# Altium schematic sheet MCU176_2.SchDoc
size A2
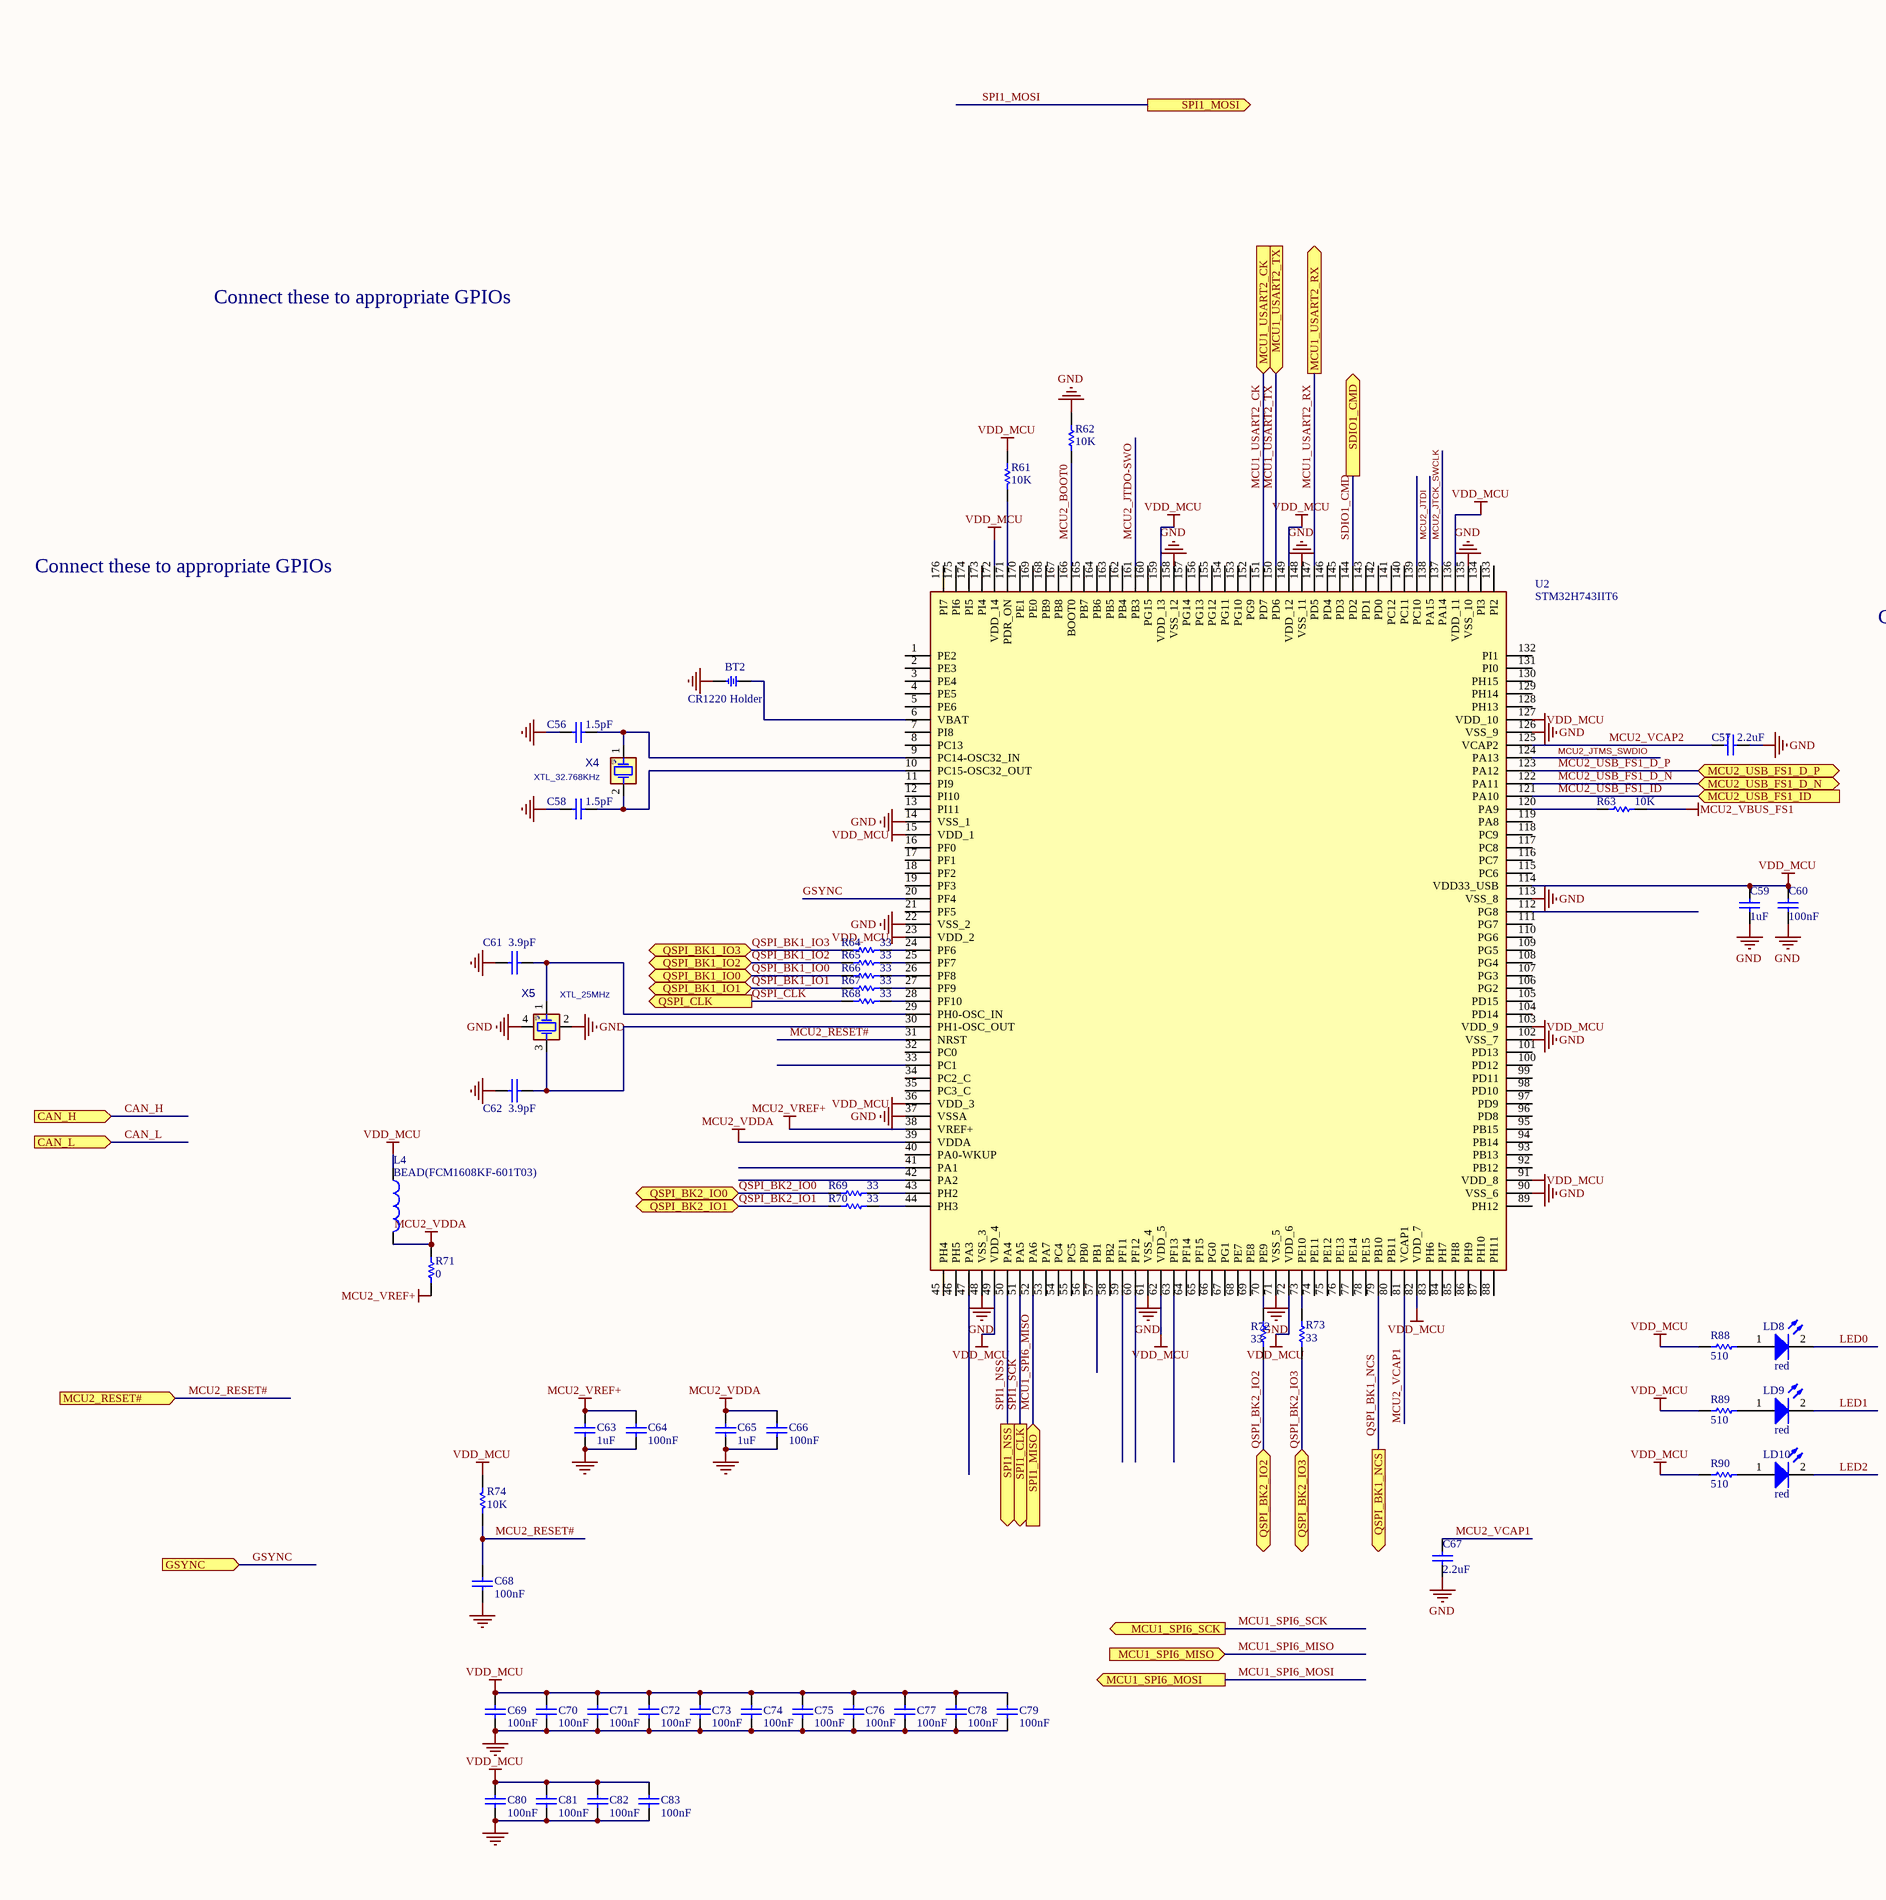
[diagram p0: MCU176_2.SchDoc, left]
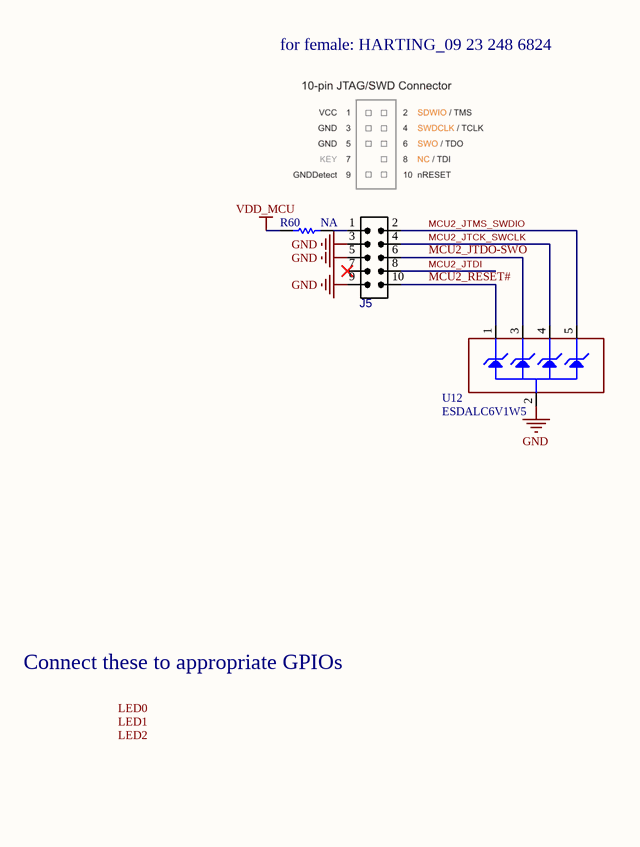
[diagram p1: MCU176_2.SchDoc, right]

## Parts
BT2  CR1220 Holder  [BTH1220]
C56  1.5pF  [C0603E]
C57  2.2uF  [C0603E]
C58  1.5pF  [C0603E]
C59  1uF  [C0603E]
C60  100nF  [C0603E]
C61  3.9pF  [C0603E]
C62  3.9pF  [C0603E]
C63  1uF  [C0603E]
C64  100nF  [C0603E]
C65  1uF  [C0603E]
C66  100nF  [C0603E]
C67  2.2uF  [C0603E]
C68  100nF  [C0603E]
C69  100nF  [C0603E]
C70  100nF  [C0603E]
C71  100nF  [C0603E]
C72  100nF  [C0603E]
C73  100nF  [C0603E]
C74  100nF  [C0603E]
C75  100nF  [C0603E]
C76  100nF  [C0603E]
C77  100nF  [C0603E]
C78  100nF  [C0603E]
C79  100nF  [C0603E]
C80  100nF  [C0603E]
C81  100nF  [C0603E]
C82  100nF  [C0603E]
C83  100nF  [C0603E]
J5  IDC_2X5  [IDC_2X5]  (value not drawn)
L4  BEAD(FCM1608KF-601T03)  [L0603E]
LD8  red  [LED0603GRN]
LD9  red  [LED0603GRN]
LD10  red  [LED0603GRN]
R60  NA  [R0603E]
R61  10K  [R0603E]
R62  10K  [R0603E]
R63  10K  [R0603E]
R64  33  [R0603E]
R65  33  [R0603E]
R66  33  [R0603E]
R67  33  [R0603E]
R68  33  [R0603E]
R69  33  [R0603E]
R70  33  [R0603E]
R71  0  [R0603E]
R72  33  [R0603E]
R73  33  [R0603E]
R74  10K  [R0603E]
R88  510  [R0603E]
R89  510  [R0603E]
R90  510  [R0603E]
U2  STM32H743IIT6  [QFP50P2600X2600X160-176N]
U12  ESDALC6V1W5  [SOT65P210X110-5N]
X4  XTL_32.768KHz  [XTL_2_1610]
X5  XTL_25MHz  [XTL_4_2016]

## Ports
CAN_H (in), CAN_L (in), GSYNC (in), MCU1_SPI6_MISO (in), MCU1_SPI6_MOSI (out), MCU1_SPI6_SCK (out), MCU1_USART2_CK (in), MCU1_USART2_RX (out), MCU1_USART2_TX (in), MCU2_RESET# (in), MCU2_USB_FS1_D_N (bidir), MCU2_USB_FS1_D_P (bidir), MCU2_USB_FS1_ID (in), QSPI_BK1_IO0 (bidir), QSPI_BK1_IO1 (bidir), QSPI_BK1_IO2 (bidir), QSPI_BK1_IO3 (bidir), QSPI_BK1_NCS (out), QSPI_BK2_IO0 (bidir), QSPI_BK2_IO1 (bidir), QSPI_BK2_IO2 (bidir), QSPI_BK2_IO3 (bidir), QSPI_CLK (out), SDIO1_CMD (out), SPI1_CLK (out), SPI1_MISO (in), SPI1_MOSI (out), SPI1_NSS (out)

## Nets
GND: BT2.2 C56.2 C57.2 C58.2 C59.1 C60.1 C61.2 C62.2 C63.1 C64.1 C65.1 C66.1 C67.1 C68.1 C69.2 C70.2 C71.2 C72.2 C73.2 C74.2 C75.2 C76.2 C77.2 C78.2 C79.2 C80.2 C81.2 C82.2 C83.2 J5.3 J5.5 J5.9 R62.2 U2.14(VSS_1) U2.22(VSS_2) U2.37(VSSA) U2.48(VSS_3) U2.61(VSS_4) U2.71(VSS_5) U2.90(VSS_6) U2.102(VSS_7) U2.113(VSS_8) U2.126(VSS_9) U2.135(VSS_10) U2.148(VSS_11) U2.158(VSS_12) U12.2(GND) X5.2(GND1) X5.4(GND2)
MCU2_VBUS_FS1: R63.1
MCU2_VDDA: C65.2 C66.2 L4.2 R71.1 U2.39(VDDA)
MCU2_VREF+: C63.2 C64.2 R71.2 U2.38(VREF+)
VDD_MCU: C59.2 C60.2 C69.1 C70.1 C71.1 C72.1 C73.1 C74.1 C75.1 C76.1 C77.1 C78.1 C79.1 C80.1 C81.1 C82.1 C83.1 L4.1 R60.2 R61.1 R74.1 R88.2 R89.2 R90.2 U2.15(VDD_1) U2.23(VDD_2) U2.36(VDD_3) U2.49(VDD_4) U2.62(VDD_5) U2.72(VDD_6) U2.82(VDD_7) U2.91(VDD_8) U2.103(VDD_9) U2.114(VDD33_USB) U2.127(VDD_10) U2.136(VDD_11) U2.149(VDD_12) U2.159(VDD_13) U2.172(VDD_14)
CAN_H: port CAN_H
CAN_L: port CAN_L
GSYNC: U2.20(PF4) ; port GSYNC
LED0: LD8.2(K)
LED1: LD9.2(K)
LED2: LD10.2(K)
MCU1_SPI6_MISO: U2.52(PA6) ; port SPI1_MISO, port MCU1_SPI6_MISO
MCU1_SPI6_MOSI: port MCU1_SPI6_MOSI
MCU1_SPI6_SCK: port MCU1_SPI6_SCK
MCU1_USART2_CK: U2.151(PD7) ; port MCU1_USART2_CK
MCU1_USART2_RX: U2.147(PD5) ; port MCU1_USART2_RX
MCU1_USART2_TX: U2.150(PD6) ; port MCU1_USART2_TX
MCU2_BOOT0: R62.1 U2.166(BOOT0)
MCU2_JTCK_SWCLK: J5.4 U2.137(PA14) U12.4(IO3)
MCU2_JTDI: J5.8 U2.138(PA15)
MCU2_JTDO-SWO: J5.6 U2.161(PB3) U12.3(IO2)
MCU2_JTMS_SWDIO: J5.2 U2.124(PA13) U12.5(IO4)
MCU2_RESET#: C68.2 J5.10 R74.2 U2.31(NRST) U12.1(IO1) ; port MCU2_RESET#
MCU2_USB_FS1_D_N: U2.122(PA11) ; port MCU2_USB_FS1_D_N
MCU2_USB_FS1_D_P: U2.123(PA12) ; port MCU2_USB_FS1_D_P
MCU2_USB_FS1_ID: U2.121(PA10) ; port MCU2_USB_FS1_ID
MCU2_VCAP1: C67.2 U2.81(VCAP1)
MCU2_VCAP2: C57.1 U2.125(VCAP2)
QSPI_BK1_IO0: R66.2 ; port QSPI_BK1_IO0
QSPI_BK1_IO1: R67.2 ; port QSPI_BK1_IO1
QSPI_BK1_IO2: R65.2 ; port QSPI_BK1_IO2
QSPI_BK1_IO3: R64.2 ; port QSPI_BK1_IO3
QSPI_BK1_NCS: U2.79(PB10) ; port QSPI_BK1_NCS
QSPI_BK2_IO0: R69.2 ; port QSPI_BK2_IO0
QSPI_BK2_IO1: R70.2 ; port QSPI_BK2_IO1
QSPI_BK2_IO2: R72.2 ; port QSPI_BK2_IO2
QSPI_BK2_IO3: R73.2 ; port QSPI_BK2_IO3
QSPI_CLK: R68.2 ; port QSPI_CLK
SDIO1_CMD: U2.144(PD2) ; port SDIO1_CMD
SPI1_MOSI: port SPI1_MOSI
SPI1_NSS: U2.50(PA4) ; port SPI1_NSS
SPI1_SCK: U2.51(PA5) ; port SPI1_CLK
NetBT2_1: BT2.1 U2.6(VBAT)
NetC56_1: C56.1 U2.9(PC14-OSC32_IN) X4.1(OSC1)
NetC58_1: C58.1 U2.10(PC15-OSC32_OUT) X4.2(OSC2)
NetC61_1: C61.1 U2.29(PH0-OSC_IN) X5.1(XA)
NetC62_1: C62.1 U2.30(PH1-OSC_OUT) X5.3(XB)
NetJ5_1: J5.1 R60.1
NetLD8_1: LD8.1(A) R88.1
NetLD9_1: LD9.1(A) R89.1
NetLD10_1: LD10.1(A) R90.1
NetR61_2: R61.2 U2.171(PDR_ON)
NetR63_2: R63.2 U2.120(PA9)
NetR64_1: R64.1 U2.24(PF6)
NetR65_1: R65.1 U2.25(PF7)
NetR66_1: R66.1 U2.26(PF8)
NetR67_1: R67.1 U2.27(PF9)
NetR68_1: R68.1 U2.28(PF10)
NetR69_1: R69.1 U2.43(PH2)
NetR70_1: R70.1 U2.44(PH3)
NetR72_1: R72.1 U2.70(PE9)
NetR73_1: R73.1 U2.73(PE10)

Not connected (* = marked no-connect by the designer): J5 7*; U2 1(PE2) 2(PE3) 3(PE4) 4(PE5) 5(PE6) 7(PI8) 8(PC13) 11(PI9) 12(PI10) 13(PI11) 16(PF0) 17(PF1) 18(PF2) 19(PF3) 21(PF5) 32(PC0) 33(PC1) 34(PC2_C) 35(PC3_C) 40(PA0-WKUP) 41(PA1) 42(PA2) 45(PH4) 46(PH5) 47(PA3) 53(PA7) 54(PC4) 55(PC5) 56(PB0) 57(PB1) 58(PB2) 59(PF11) 60(PF12) 63(PF13) 64(PF14) 65(PF15) 66(PG0) 67(PG1) 68(PE7) 69(PE8) 74(PE11) 75(PE12) 76(PE13) 77(PE14) 78(PE15) 80(PB11) 83(PH6) 84(PH7) 85(PH8) 86(PH9) 87(PH10) 88(PH11) 89(PH12) 92(PB12) 93(PB13) 94(PB14) 95(PB15) 96(PD8) 97(PD9) 98(PD10) 99(PD11) 100(PD12) 101(PD13) 104(PD14) 105(PD15) 106(PG2) 107(PG3) 108(PG4) 109(PG5) 110(PG6) 111(PG7) 112(PG8) 115(PC6) 116(PC7) 117(PC8) 118(PC9) 119(PA8) 128(PH13) 129(PH14) 130(PH15) 131(PI0) 132(PI1) 133(PI2) 134(PI3) 139(PC10) 140(PC11) 141(PC12) 142(PD0) 143(PD1) 145(PD3) 146(PD4) 152(PG9) 153(PG10) 154(PG11) 155(PG12) 156(PG13) 157(PG14) 160(PG15) 162(PB4) 163(PB5) 164(PB6) 165(PB7) 167(PB8) 168(PB9) 169(PE0) 170(PE1) 173(PI4) 174(PI5) 175(PI6) 176(PI7)

## Notes on the sheet
- for female: HARTING_09 23 248 6824
- Connect these to appropriate GPIOs
- Labels drawn without touching a wire or pin: LED0, LED1, LED2

## Library data of the parts
BT2 = BATH_CR1220: BATTERY HOLDER, CR1220; VALUE: BAT3volt; MANF_P#: -; .: http://www.chila.ir
C56 C58 = Capacitor_ST: Capacitor 0402 / 0603 / 0805; Value: 100nF; Revision: July-2002: Re-released for DXP Platform.
C57 C59 C60 C63-C67 = Cap: Capacitor; Value: 10nF; Published: 8-Jun-2000; Revision: July-2002: Re-released for DXP Platform.; Publisher: Altium Limited
C61 C62 C69-C83 = CAP: Capacitor
  C69-C83: Published: 8-Jun-2000; Revision: July-2002: Re-released for DXP Platform.; Publisher: Altium Limited; Value: 100nF
C68 = CAP: Capacitor; Value: 100pF; Published: 8-Jun-2000; Revision: July-2002: Re-released for DXP Platform.; Publisher: Altium Limited
J5 = IDC_2X5: CONN, IDC, Male, pitch: 2.54mm, 10POS; VALUE: IDC_2X5
L4 = Inductor: Value: 100uH; Published: 8-Jun-2000; Revision: July-2002: Re-released for DXP Platform.; Publisher: Altium Limited
LD8-LD10 = LED2: Typical RED, GREEN, YELLOW, AMBER GaAs LED; Published: 8-Jun-2000; Revision: July-2002: Re-released for DXP Platform.; Publisher: Altium Limited
R60 R61 R63-R74 = Res1: Resistor; Value: 1K; Published: 8-Jun-2000; Revision: July-2002: Re-released for DXP Platform.; Publisher: Altium Limited
R62 R88-R90 = res1: Resistor; Value: 1K; Published: 8-Jun-2000; Revision: July-2002: Re-released for DXP Platform.; Publisher: Altium Limited
U2 = STM32H743IIT6: Integrated Circuit; Manufacturer_Name: STMicroelectronics; Datasheet Link: https://componentsearchengine.com/Datasheets/1/STM32H743IIT6.pdf; Height: 1.6mm; Manufacturer_Part_Number: STM32H743IIT6; Mouser Part Number: 511-STM32H743IIT6; Mouser Price/Stock: https://www.mouser.co.uk/ProductDetail/STMicroelectronics/STM32H743IIT6?qs=FNcb6ahWXRzE163cq8Rfjg%3D%3D; Arrow Part Number: STM32H743IIT6; Arrow Price/Stock: https://www.arrow.com/en/products/stm32h743iit6/stmicroelectronics?region=nac
U12 = ESDALC6V1W5: Dual Transil array for ESD protection; Manuf_1: STM; Manuf_Part_1: ESDA5V3L; Ref St: 9179034; Provided: ST; ECCN_US/EU: EAR99/NEC; Distrib: ST; Order: ESDA5V3L; Ordered by: STM
X4 = XTL_2_32.768_3215A: Crystal; MANF_P#: ABS05-32.768KHZ-9-T; PARAM2: 7pF, 20PPM; PARAM: -40~85oC; MANF: -; PRICE: 1$; VALUE: XTL_32.768KHz
X5 = XTL_4_25MHz_3225: CRYSTAL; PARAM: 10PPM; DESC: DESCRIPTION; DIST#: MOUSER; PARAM2: PARAM; MANF_P#: XRCGB25M000F1H00R0; MANF: -; ASSEMBLY: ASSEMBLY; PRICE: 0.5$; VALUE: XTL_25MHz